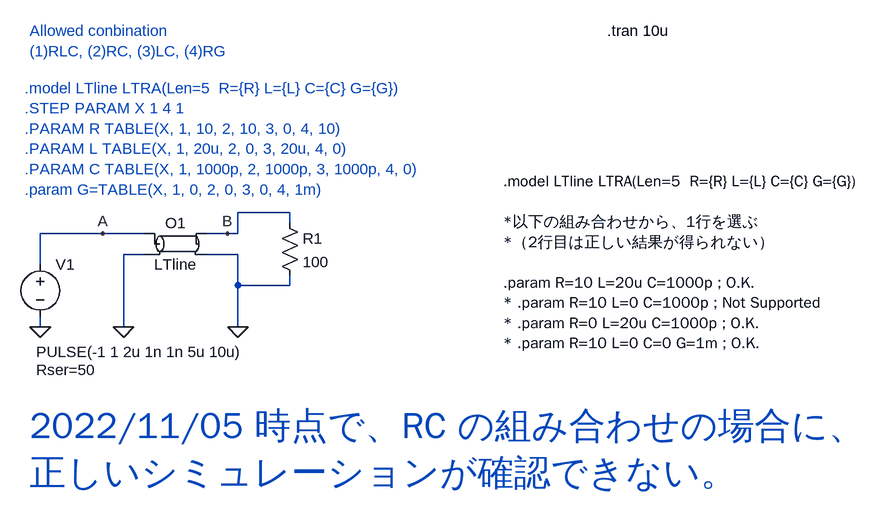
[diagram p0: schematic Fig_2-147_LTRA.asc]
Fig_2-147_LTRA.asc, the LTspice schematic file:
Version 4
SHEET 1 2132 680
WIRE 400 112 320 112
WIRE 400 128 400 112
WIRE 112 144 16 144
WIRE 176 144 112 144
WIRE 304 144 272 144
WIRE 320 144 320 112
WIRE 320 144 304 144
WIRE 176 176 144 176
WIRE 320 176 272 176
WIRE 16 192 16 144
WIRE 320 224 320 176
WIRE 400 224 400 208
WIRE 400 224 320 224
WIRE 16 288 16 272
WIRE 144 288 144 176
WIRE 320 288 320 224
FLAG 320 288 0
FLAG 144 288 0
FLAG 16 288 0
FLAG 112 144 A
FLAG 304 144 B
SYMBOL res 384 112 R0
SYMATTR InstName R1
SYMATTR Value 100
SYMBOL ltline 224 160 R0
SYMATTR InstName O1
SYMATTR Value LTline
SYMBOL voltage 16 176 R0
WINDOW 3 -6 150 Left 2
WINDOW 123 0 0 Left 0
WINDOW 39 -6 178 Left 2
SYMATTR InstName V1
SYMATTR Value PULSE(-1 1 2u 1n 1n 5u 10u)
SYMATTR SpiceLine Rser=50
TEXT 888 -168 Left 2 !.tran 10u
TEXT 0 -168 Left 2 ;Allowed conbination \n(1)RLC, (2)RC, (3)LC, (4)RG
TEXT -8 -80 Left 2 ;.model LTline LTRA(Len=5  R={R} L={L} C={C} G={G})\n.STEP PARAM X 1 4 1\n.PARAM R TABLE(X, 1, 10, 2, 10, 3, 0, 4, 10)\n.PARAM L TABLE(X, 1, 20u, 2, 0, 3, 20u, 4, 0)\n.PARAM C TABLE(X, 1, 1000p, 2, 1000p, 3, 1000p, 4, 0)\n.param G=TABLE(X, 1, 0, 2, 0, 3, 0, 4, 1m)
TEXT 0 440 Left 5 ;2022/11/05 時点で、RC の組み合わせの場合に、\n正しいシミュレーションが確認できない。
TEXT 728 64 Left 2 !.model LTline LTRA(Len=5  R={R} L={L} C={C} G={G})\n \n*以下の組み合わせから、1行を選ぶ\n*（2行目は正しい結果が得られない）\n \n.param R=10 L=20u C=1000p ; O.K.\n* .param R=10 L=0 C=1000p ; Not Supported\n* .param R=0 L=20u C=1000p ; O.K.\n* .param R=10 L=0 C=0 G=1m ; O.K.

The netlist it stands for:
* Fig_2-147_LTRA.asc
R1 B 0 100
O1 A 0 B 0 LTline
V1 A 0 PULSE(-1 1 2u 1n 1n 5u 10u) Rser=50
.tran 10u
* Allowed conbination
* (1)RLC, (2)RC, (3)LC, (4)RG
* .model LTline LTRA(Len=5  R={R} L={L} C={C} G={G})
* .STEP PARAM X 1 4 1
* .PARAM R TABLE(X, 1, 10, 2, 10, 3, 0, 4, 10)
* .PARAM L TABLE(X, 1, 20u, 2, 0, 3, 20u, 4, 0)
* .PARAM C TABLE(X, 1, 1000p, 2, 1000p, 3, 1000p, 4, 0)
* .param G=TABLE(X, 1, 0, 2, 0, 3, 0, 4, 1m)
* 2022/11/05 時点で、RC の組み合わせの場合に、
* 正しいシミュレーションが確認できない。
.model LTline LTRA(Len=5  R={R} L={L} C={C} G={G})
*以下の組み合わせから、1行を選ぶ
*（2行目は正しい結果が得られない）
.param R=10 L=20u C=1000p ; O.K.
* .param R=10 L=0 C=1000p ; Not Supported
* .param R=0 L=20u C=1000p ; O.K.
* .param R=10 L=0 C=0 G=1m ; O.K.
.backanno
.end